# EAGLE design PCB4 (EAGLE 8.1.0)
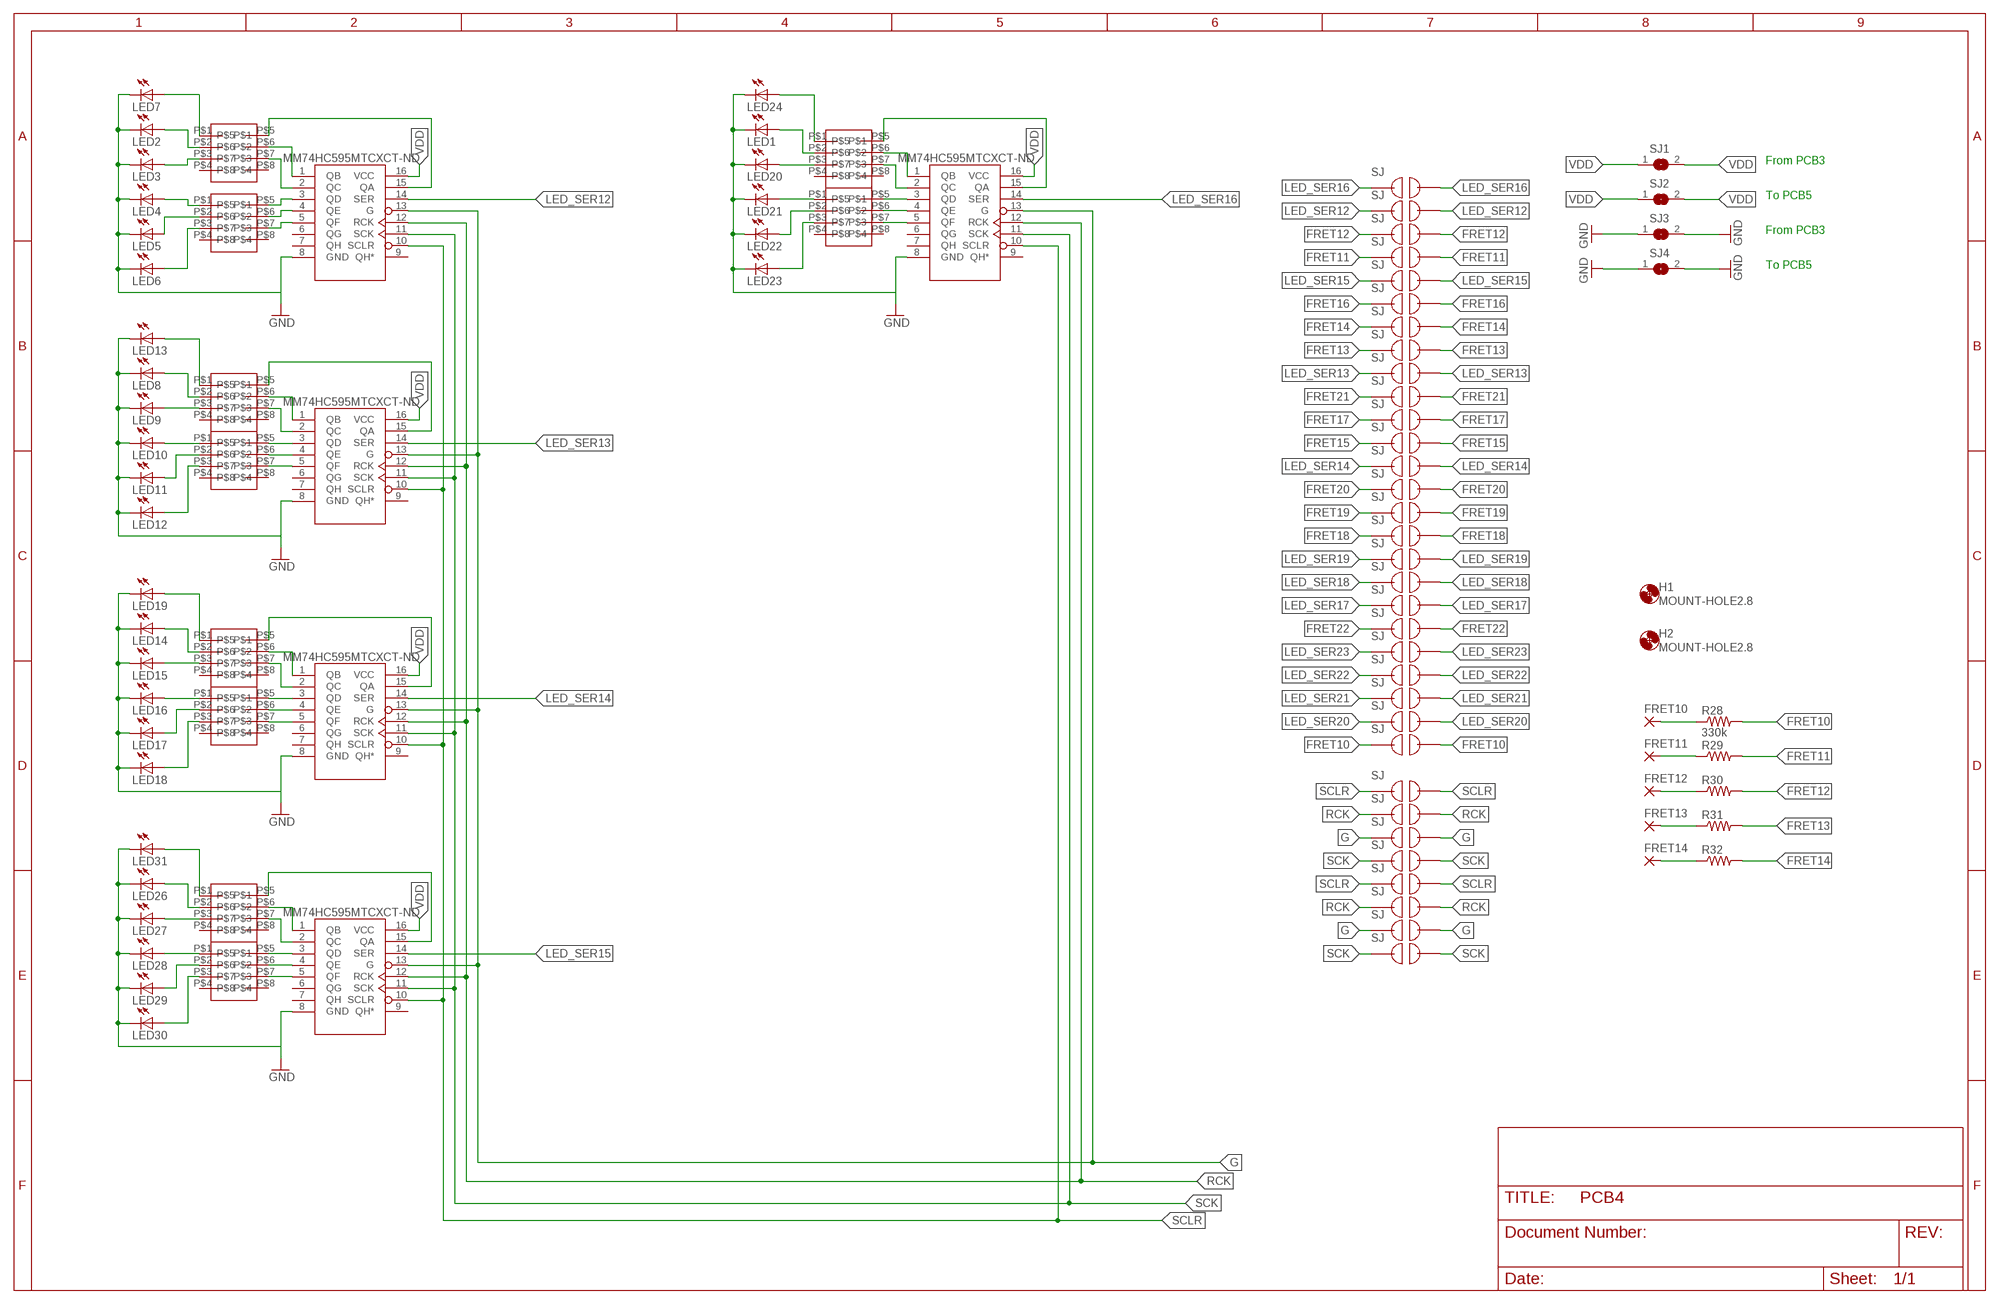
[diagram p0: schematic, sheet 1]

## Parts
FRET10  2,54/0,9  [2,54/0,9]
FRET11  2,54/0,9  [2,54/0,9]
FRET12  2,54/0,9  [2,54/0,9]
FRET13  2,54/0,9  [2,54/0,9]
FRET14  2,54/0,9  [2,54/0,9]
H1  MOUNT-HOLE2.8  [2,8]
H2  MOUNT-HOLE2.8  [2,8]
LED1  LEDSMT1206  [1206]
LED2  LEDSMT1206  [1206]
LED3  LEDSMT1206  [1206]
LED4  LEDSMT1206  [1206]
LED5  LEDSMT1206  [1206]
LED6  LEDSMT1206  [1206]
LED7  LEDSMT1206  [1206]
LED8  LEDSMT1206  [1206]
LED9  LEDSMT1206  [1206]
LED10  LEDSMT1206  [1206]
LED11  LEDSMT1206  [1206]
LED12  LEDSMT1206  [1206]
LED13  LEDSMT1206  [1206]
LED14  LEDSMT1206  [1206]
LED15  LEDSMT1206  [1206]
LED16  LEDSMT1206  [1206]
LED17  LEDSMT1206  [1206]
LED18  LEDSMT1206  [1206]
LED19  LEDSMT1206  [1206]
LED20  LEDSMT1206  [1206]
LED21  LEDSMT1206  [1206]
LED22  LEDSMT1206  [1206]
LED23  LEDSMT1206  [1206]
LED24  LEDSMT1206  [1206]
LED26  LEDSMT1206  [1206]
LED27  LEDSMT1206  [1206]
LED28  LEDSMT1206  [1206]
LED29  LEDSMT1206  [1206]
LED30  LEDSMT1206  [1206]
LED31  LEDSMT1206  [1206]
R28  330k  R-US_R0805  [R0805]
R29  R-US_R0805  [R0805]
R30  R-US_R0805  [R0805]
R31  R-US_R0805  [R0805]
R32  R-US_R0805  [R0805]
SJ1  SJ  [SJ]
SJ2  SJ  [SJ]
SJ3  SJ  [SJ]
SJ4  SJ  [SJ]
U$1  MM74HC595TSSOP-LD16  [MM74HC595MTCXCT-ND]
U$2  MM74HC595TSSOP-LD16  [MM74HC595MTCXCT-ND]
U$3  MM74HC595TSSOP-LD16  [MM74HC595MTCXCT-ND]
U$4  MM74HC595TSSOP-LD16  [MM74HC595MTCXCT-ND]
U$5  MM74HC595TSSOP-LD16  [MM74HC595MTCXCT-ND]
U$6  MNR04MRAPJ680  [MNR04]
U$7  MNR04MRAPJ680  [MNR04]
U$8  MNR04MRAPJ680  [MNR04]
U$9  MNR04MRAPJ680  [MNR04]
U$10  MNR04MRAPJ680  [MNR04]
U$11  MNR04MRAPJ680  [MNR04]
U$12  MNR04MRAPJ680  [MNR04]
U$13  MNR04MRAPJ680  [MNR04]
U$14  MNR04MRAPJ680  [MNR04]
U$15  MNR04MRAPJ680  [MNR04]
U$19  JUMPER  [JUMPER]
U$42  JUMPER  [JUMPER]
U$45  JUMPER  [JUMPER]
U$46  JUMPER  [JUMPER]
U$47  JUMPER  [JUMPER]
U$48  JUMPER  [JUMPER]
U$49  JUMPER  [JUMPER]
U$50  JUMPER  [JUMPER]
U$51  JUMPER  [JUMPER]
U$52  JUMPER  [JUMPER]
U$53  JUMPER  [JUMPER]
U$54  JUMPER  [JUMPER]
U$55  JUMPER  [JUMPER]
U$56  JUMPER  [JUMPER]
U$57  JUMPER  [JUMPER]
U$58  JUMPER  [JUMPER]
U$59  JUMPER  [JUMPER]
U$60  JUMPER  [JUMPER]
U$61  JUMPER  [JUMPER]
U$62  JUMPER  [JUMPER]
U$63  JUMPER  [JUMPER]
U$64  JUMPER  [JUMPER]
U$65  JUMPER  [JUMPER]
U$66  JUMPER  [JUMPER]
U$67  JUMPER  [JUMPER]
U$68  JUMPER  [JUMPER]
U$69  JUMPER  [JUMPER]
U$79  JUMPER  [JUMPER]
U$80  JUMPER  [JUMPER]
U$81  JUMPER  [JUMPER]
U$82  JUMPER  [JUMPER]
U$83  JUMPER  [JUMPER]
U$84  JUMPER  [JUMPER]

## Nets
FRET10: R28.2 U$69.P$1 U$69.P$2
FRET11: R29.2 U$48.P$1 U$48.P$2
FRET12: R30.2 U$47.P$1 U$47.P$2
FRET13: R31.2 U$52.P$1 U$52.P$2
FRET14: R32.2 U$51.P$1 U$51.P$2
FRET15: U$56.P$1 U$56.P$2
FRET16: U$50.P$1 U$50.P$2
FRET17: U$55.P$1 U$55.P$2
FRET18: U$60.P$1 U$60.P$2
FRET19: U$59.P$1 U$59.P$2
FRET20: U$58.P$1 U$58.P$2
FRET21: U$54.P$1 U$54.P$2
FRET22: U$64.P$1 U$64.P$2
G: U$1.13(G) U$2.13(G) U$3.13(G) U$4.13(G) U$5.13(G) U$80.P$1 U$80.P$2 U$84.P$1 U$84.P$2
GND: LED1.C LED2.C LED3.C LED4.C LED5.C LED6.C LED7.C LED8.C LED9.C LED10.C LED11.C LED12.C LED13.C LED14.C LED15.C LED16.C LED17.C LED18.C LED19.C LED20.C LED21.C LED22.C LED23.C LED24.C LED26.C LED27.C LED28.C LED29.C LED30.C LED31.C SJ3.1 SJ3.2 SJ4.1 SJ4.2 U$1.8(GND) U$2.8(GND) U$3.8(GND) U$4.8(GND) U$5.8(GND)
LED_SER12: U$4.14(SER) U$46.P$1 U$46.P$2
LED_SER13: U$1.14(SER) U$53.P$1 U$53.P$2
LED_SER14: U$3.14(SER) U$57.P$1 U$57.P$2
LED_SER15: U$5.14(SER) U$49.P$1 U$49.P$2
LED_SER16: U$2.14(SER) U$45.P$1 U$45.P$2
LED_SER17: U$63.P$1 U$63.P$2
LED_SER18: U$62.P$1 U$62.P$2
LED_SER19: U$61.P$1 U$61.P$2
LED_SER20: U$68.P$1 U$68.P$2
LED_SER21: U$67.P$1 U$67.P$2
LED_SER22: U$66.P$1 U$66.P$2
LED_SER23: U$65.P$1 U$65.P$2
N$1: LED2.A U$6.P$2
N$2: U$4.1(QB) U$6.P$6
N$3: LED3.A U$6.P$3
N$4: U$4.2(QC) U$6.P$7
N$5: LED4.A U$7.P$1
N$6: LED7.A U$6.P$1
N$7: U$4.15(QA) U$6.P$5
N$8: LED5.A U$7.P$2
N$9: U$4.3(QD) U$7.P$5
N$10: U$4.4(QE) U$7.P$6
N$11: U$4.5(QF) U$7.P$7
N$12: LED6.A U$7.P$3
N$13: LED13.A U$8.P$1
N$14: LED8.A U$8.P$2
N$15: U$1.1(QB) U$8.P$6
N$16: U$1.2(QC) U$8.P$7
N$17: LED9.A U$8.P$3
N$18: LED10.A U$9.P$1
N$19: U$1.3(QD) U$9.P$5
N$20: LED11.A U$9.P$2
N$21: U$1.4(QE) U$9.P$6
N$22: U$1.5(QF) U$9.P$7
N$23: LED12.A U$9.P$3
N$24: U$1.15(QA) U$8.P$5
N$25: LED19.A U$10.P$1
N$26: LED14.A U$10.P$2
N$27: U$3.1(QB) U$10.P$6
N$28: U$3.2(QC) U$10.P$7
N$29: LED15.A U$10.P$3
N$30: LED16.A U$11.P$1
N$31: U$3.3(QD) U$11.P$5
N$32: U$3.4(QE) U$11.P$6
N$33: U$3.5(QF) U$11.P$7
N$34: LED18.A U$11.P$3
N$35: LED17.A U$11.P$2
N$36: LED31.A U$12.P$1
N$37: LED26.A U$12.P$2
N$38: LED27.A U$12.P$3
N$39: U$5.2(QC) U$12.P$7
N$40: U$3.15(QA) U$10.P$5
N$41: U$5.1(QB) U$12.P$6
N$42: U$5.3(QD) U$13.P$5
N$43: U$5.4(QE) U$13.P$6
N$44: U$5.5(QF) U$13.P$7
N$45: U$2.15(QA) U$14.P$5
N$46: LED28.A U$13.P$1
N$47: LED29.A U$13.P$2
N$48: LED30.A U$13.P$3
N$49: LED24.A U$14.P$1
N$50: LED1.A U$14.P$2
N$51: LED20.A U$14.P$3
N$52: U$2.1(QB) U$14.P$6
N$53: U$2.2(QC) U$14.P$7
N$54: U$2.3(QD) U$15.P$5
N$55: U$2.4(QE) U$15.P$6
N$56: U$2.5(QF) U$15.P$7
N$57: LED23.A U$15.P$3
N$58: FRET10.1(P) R28.1
N$59: FRET11.1(P) R29.1
N$60: LED22.A U$15.P$2
N$61: LED21.A U$15.P$1
N$62: FRET12.1(P) R30.1
N$63: FRET13.1(P) R31.1
N$64: FRET14.1(P) R32.1
N$66: U$5.15(QA) U$12.P$5
RCK: U$1.12(RCK) U$2.12(RCK) U$3.12(RCK) U$4.12(RCK) U$5.12(RCK) U$79.P$1 U$79.P$2 U$83.P$1 U$83.P$2
SCK: U$1.11(SCK) U$2.11(SCK) U$3.11(SCK) U$4.11(SCK) U$5.11(SCK) U$42.P$1 U$42.P$2 U$81.P$1 U$81.P$2
SCLR: U$1.10(SCLR) U$2.10(SCLR) U$3.10(SCLR) U$4.10(SCLR) U$5.10(SCLR) U$19.P$1 U$19.P$2 U$82.P$1 U$82.P$2
VDD: SJ1.1 SJ1.2 SJ2.1 SJ2.2 U$1.16(VCC) U$2.16(VCC) U$3.16(VCC) U$4.16(VCC) U$5.16(VCC)
Unconnected: U$1.6(QG) U$1.7(QH) U$1.9(QH*) U$2.6(QG) U$2.7(QH) U$2.9(QH*) U$3.6(QG) U$3.7(QH) U$3.9(QH*) U$4.6(QG) U$4.7(QH) U$4.9(QH*) U$5.6(QG) U$5.7(QH) U$5.9(QH*) U$6.P$4 U$6.P$8 U$7.P$4 U$7.P$8 U$8.P$4 U$8.P$8 U$9.P$4 U$9.P$8 U$10.P$4 U$10.P$8 U$11.P$4 U$11.P$8 U$12.P$4 U$12.P$8 U$13.P$4 U$13.P$8 U$14.P$4 U$14.P$8 U$15.P$4 U$15.P$8

## Notes on the sheet
- From PCB3
- To PCB5
- From PCB3
- To PCB5

## Library data of the parts
FRET10-FRET14 = wirepad:2,54/0,9: THROUGH-HOLE PAD
H1 H2 = holes:MOUNT-HOLE: MOUNTING HOLE with drill center marker
LED1-LED24 LED26-LED31 = led:LED: LED OSRAM: - CHIPLED LG R971, LG N971, LY N971, LG Q971, LY Q971, LO R971, LY R971 LH N974, LH R974 LS Q976, LO Q976, LY Q976 LO Q996 - Hyper CHIPLED LW Q18S LB Q993, LB Q99A, LB R99A - SideLED LS A670, LO A670, LY A670, LG A670, LP A670 LB A673, LV A673, LT A673, LW A673 LH A674 LY A675 LS A676, LA A676, LO A676, LY A676, LW A676 LS A679, LY A679, LG A679 - Hyper Micro SIDELED® LS Y876, LA Y876, LO Y876, LY Y876 LT Y87S - SmartLED LW L88C, LW L88S LB L89C, LB L89S, LG L890 LS L89K, LO L89K, LY L89K LS L896, LA L896, LO L896, LY L896 - TOPLED LS T670, LO T670, LY T670, LG T670, LP T670 LSG T670, LSP T670, LSY T670, LOP T670, LYG T670 LG T671, LOG T671, LSG T671 LB T673, LV T673, LT T673, LW T673 LH T674 LS T676, LA T676, LO T676, LY T676, LB T676, LH T676, LSB T676, LW T676 LB T67C, LV T67C, LT T67C, LS T67K, LO T67K, LY T67K, LW E67C LS E67B, LA E67B, LO E67B, LY E67B, LB E67C, LV E67C, LT E67C LW T67C LS T679, LY T679, LG T679 LS T770, LO T770, LY T770, LG T770, LP T770 LB T773, LV T773, LT T773, LW T773 LH T774 LS E675, LA E675, LY E675, LS T675 LS T776, LA T776, LO T776, LY T776, LB T776 LHGB T686 LT T68C, LB T68C - Hyper Mini TOPLED® LB M676 - Mini TOPLED Santana® LG M470 LS M47K, LO M47K, LY M47K Source: http://www.osram.convergy.de LUXEON: - LUMILED® LXK2-PW12-R00, LXK2-PW12-S00, LXK2-PW14-U00, LXK2-PW14-V00 LXK2-PM12-R00, LXK2-PM12-S00, LXK2-PM14-U00 LXK2-PE12-Q00, LXK2-PE12-R00, LXK2-PE12-S00, LXK2-PE14-T00, LXK2-PE14-U00 LXK2-PB12-K00, LXK2-PB12-L00, LXK2-PB12-M00, LXK2-PB14-N00, LXK2-PB14-P00, LXK2-PB14-Q00 LXK2-PR12-L00, LXK2-PR12-M00, LXK2-PR14-Q00, LXK2-PR14-R00 LXK2-PD12-Q00, LXK2-PD12-R00, LXK2-PD12-S00 LXK2-PH12-R00, LXK2-PH12-S00 LXK2-PL12-P00, LXK2-PL12-Q00, LXK2-PL12-R00 Source: www.luxeon.com KINGBRIGHT: KA-3528ASYC Source: www.kingbright.com
R28-R32 = rcl:R-US_: RESISTOR, American symbol
SJ1-SJ4 = jumper:SJ: SMD solder JUMPER
U$1-U$5 = ECE477_Guitutar:MM74HC595
U$6-U$15 = ECE477_Guitutar:MNR04MRAPJ680
U$19 U$42 U$45-U$69 U$79-U$84 = ECE477_Guitutar:JUMPER

## Board
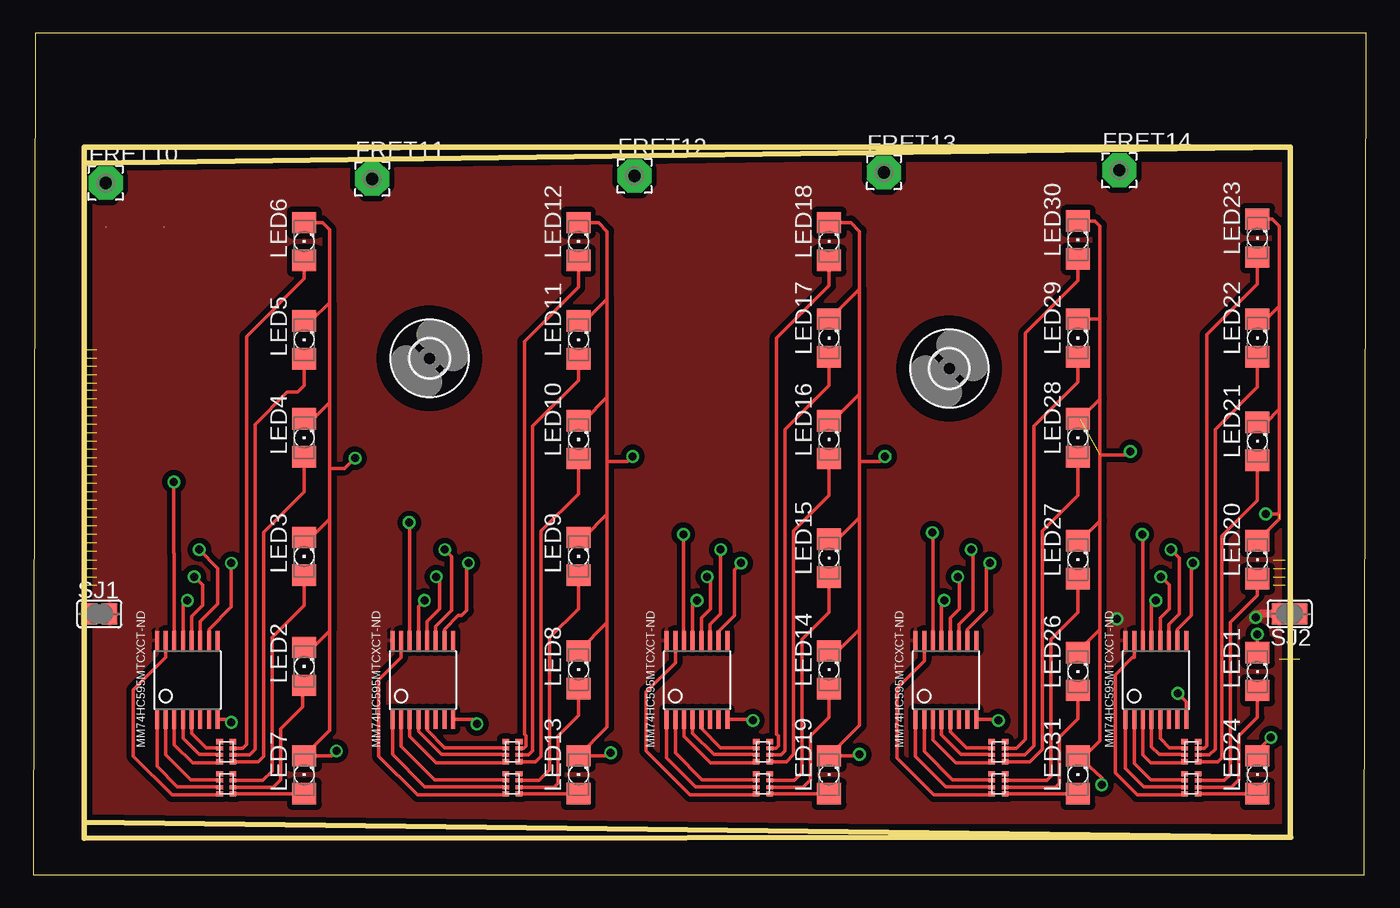
[diagram p1: board, top side]
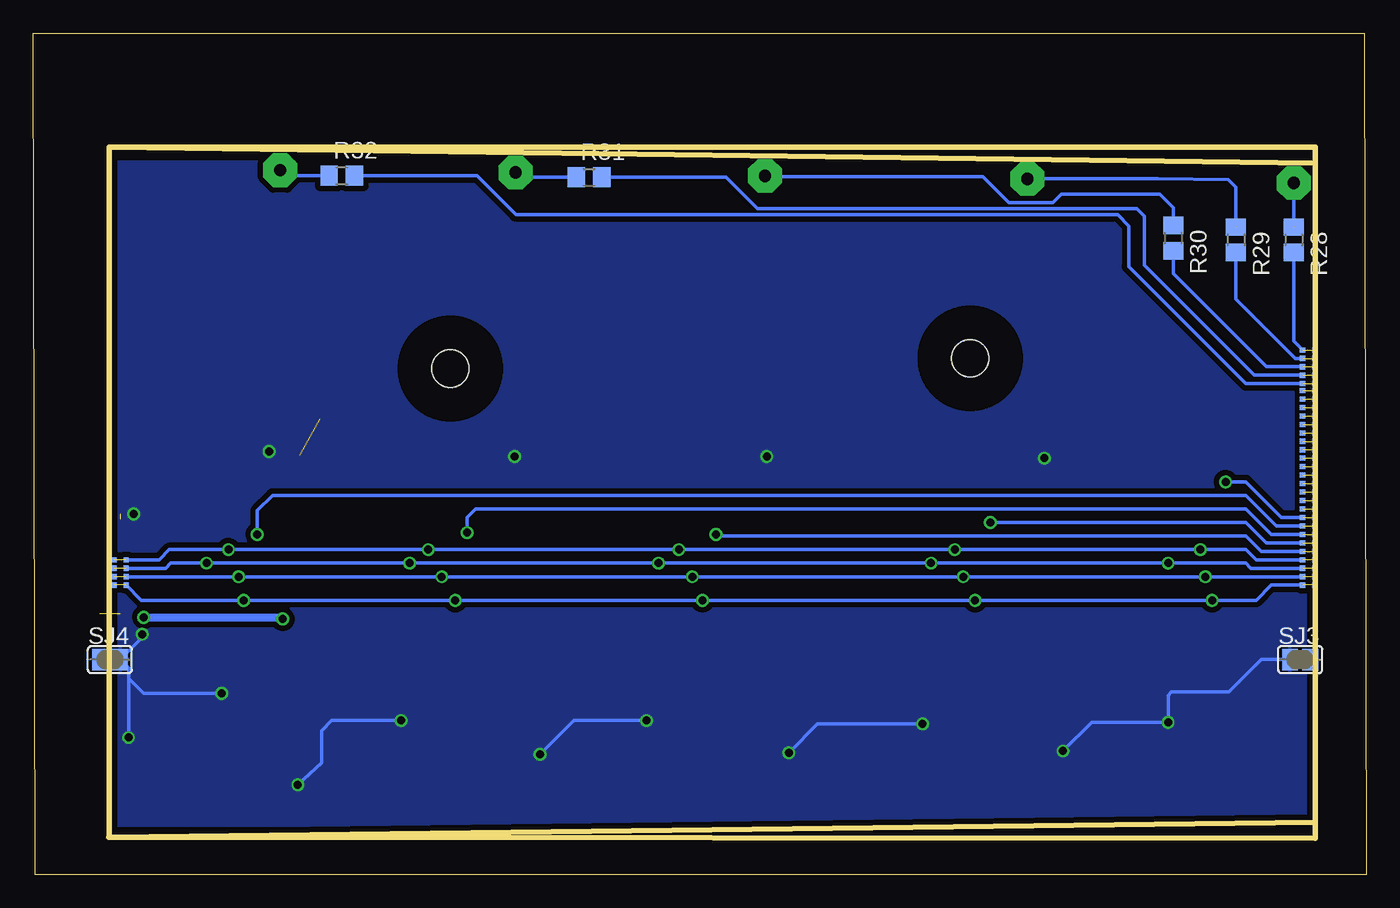
[diagram p2: board, bottom side, seen from below]

Size 99.98 x 63.12 mm. Coordinates in mm from the lower left corner, seen from the top.
Outline: 94.28,54.56 3.81,54.56 3.81,53.39
Outline: 94.28,54.56 94.3,54.56 94.3,2.79 3.81,2.74 3.81,3.94
Outline: 3.81,3.94 3.81,7.49 3.81,15.49 3.81,53.39
Outline: 94.28,54.56 3.81,53.39
Outline: 94.31,2.79 3.81,3.94
Outline: 0,0 99.85,0 99.98,63.12 0.13,63.12 0,0
Copper layers (1*16): Top 0.0356mm / dielectric 1.5011mm / Bottom 0.0356mm
Design rules "ECE_Senior_Design": minimum track width 8mil, minimum drill 13mil, track to track 8mil, track to pad 8mil, pad to pad 6mil, via to via 8mil, smd to smd 6mil, copper to edge 15mil, drill to drill 8mil, minimum pad ring 7mil, minimum via ring 7mil, stop-mask expansion 3mil, vias tented up to drill 0mil, thermal gap 10mil

### Footprints (pad centres in the part's own frame; a part is rotated, then mirrored left to right if it is on the bottom)
2,54/0,9 = drill 0.914 pad 2.54 octagon: 1 0,0
2,8 = hole 2.8: 0,0
1206 = smd 1.6 x 1.803: A -1.422,0; C 1.422,0
R0805 = smd 1.3 x 1.5: 1 -0.95,0; 2 0.95,0
SJ = smd 1.168 x 1.6: 1 -0.762,0; 2 0.762,0
MM74HC595MTCXCT-ND = smd 0.3 x 1.45: 1 -2.275,-2.95; 2 -1.625,-2.95; 3 -0.975,-2.95; 4 -0.325,-2.95; 5 0.325,-2.95; 6 0.975,-2.95; 7 1.625,-2.95; 8 2.275,-2.95; 9 2.275,2.95; 10 1.625,2.95; 11 0.975,2.95; 12 0.325,2.95; 13 -0.325,2.95; 14 -0.975,2.95; 15 -1.625,2.95; 16 -2.275,2.95
MNR04 = smd 0.4 x 0.5: P$1 -0.8,-0.5; P$4 0.7,-0.5; P$5 -0.8,0.5; P$8 0.7,0.5 | smd 0.3 x 0.5: P$2 -0.3,-0.5; P$3 0.2,-0.5; P$6 -0.3,0.5; P$7 0.2,0.5
JUMPER = smd 0.381 x 0.381: P$1 -0.454,0; P$2 0.454,0

### Placement (x,y rotation side)
FRET10  5.42,51.89 0 top
FRET11  25.41,52.2 0 top
FRET12  45.1,52.43 0 top
FRET13  63.8,52.68 0 top
FRET14  81.46,52.84 0 top
H1  68.71,37.97 0 top
H2  29.72,38.73 0 top
LED1  91.82,15.24 90 top
LED2  20.32,15.62 90 top
LED3  20.32,23.88 90 top
LED4  20.32,32.77 90 top
LED5  20.32,40.13 90 top
LED6  20.32,47.5 90 top
LED7  20.32,7.49 90 top
LED8  40.89,15.37 90 top
LED9  40.89,23.88 90 top
LED10  40.89,32.64 90 top
LED11  40.89,40.13 90 top
LED12  40.89,47.5 90 top
LED13  40.89,7.49 90 top
LED14  59.69,15.37 90 top
LED15  59.69,23.75 90 top
LED16  59.69,32.64 90 top
LED17  59.69,40.26 90 top
LED18  59.69,47.5 90 top
LED19  59.69,7.49 90 top
LED20  91.82,23.62 90 top
LED21  91.82,32.51 90 top
LED22  91.82,40.26 90 top
LED23  91.82,47.75 90 top
LED24  91.82,7.49 90 top
LED26  78.36,15.24 90 top
LED27  78.36,23.62 90 top
LED28  78.36,32.77 90 top
LED29  78.36,40.26 90 top
LED30  78.36,47.62 90 top
LED31  78.36,7.49 90 top
R28  5.44,47.62 270 bottom
R29  9.77,47.62 270 bottom
R30  14.48,47.75 270 bottom
R31  58.29,52.31 0 bottom
R32  76.83,52.43 0 bottom
SJ1  4.95,19.56 0 top
SJ2  94.23,19.56 180 top
SJ3  4.95,16.13 0 bottom
SJ4  94.23,16.13 0 bottom
U$1  29.21,14.61 0 top
U$2  84.2,14.61 0 top
U$3  49.78,14.61 0 top
U$4  11.56,14.61 0 top
U$5  68.45,14.61 0 top
U$6  14.48,6.86 90 top
U$7  14.48,9.27 90 top
U$8  35.94,6.86 90 top
U$9  35.94,9.27 90 top
U$10  54.74,6.86 90 top
U$11  54.74,9.27 90 top
U$12  72.39,6.86 90 top
U$13  72.39,9.27 90 top
U$14  86.87,6.86 90 top
U$15  86.87,9.27 90 top
U$19  4.32,22.99 0 bottom
U$42  4.32,23.62 0 bottom
U$45  4.32,26.16 0 bottom
U$46  4.32,26.8 0 bottom
U$47  4.32,38.1 0 bottom
U$48  4.32,38.73 0 bottom
U$49  4.32,25.53 0 bottom
U$50  4.32,35.69 0 bottom
U$51  4.32,36.83 0 bottom
U$52  4.32,37.47 0 bottom
U$53  4.32,24.89 180 bottom
U$54  4.32,32.51 0 bottom
U$55  4.32,35.05 0 bottom
U$56  4.32,36.32 0 bottom
U$57  4.32,24.26 180 bottom
U$58  4.32,33.15 0 bottom
U$59  4.32,33.78 0 bottom
U$60  4.32,34.42 0 bottom
U$61  4.32,29.97 0 bottom
U$62  4.32,30.61 0 bottom
U$63  4.32,31.24 0 bottom
U$64  4.32,31.88 0 bottom
U$65  4.32,27.43 0 bottom
U$66  4.32,28.07 0 bottom
U$67  4.32,28.7 0 bottom
U$68  4.32,29.34 0 bottom
U$69  4.32,39.37 0 bottom
U$79  4.32,22.35 0 bottom
U$80  4.32,21.72 0 bottom
U$81  93.47,23.62 0 bottom
U$82  93.47,22.99 0 bottom
U$83  93.47,22.35 0 bottom
U$84  93.47,21.72 0 bottom

### Tracks (layer width: path | path; a pad name or v marks a point on that pad's centre or on a via)
FRET10  (1 unrouted)
  Bottom 0.254: R28.2 5.44,40.03 U$69.P$1
FRET11  (1 unrouted)
  Bottom 0.254: U$48.P$1 5.33,38.73 9.78,43.18 9.78,45.93 9.77,45.94 R29.2
FRET12  (1 unrouted)
  Bottom 0.254: R30.2 14.48,45.09 7.49,38.1 U$47.P$1
FRET13  (1 unrouted)
  Bottom 0.254: R31.2 48.01,52.31 45.66,49.96 17.2,49.96 16.64,49.4 16.64,45.72 8.38,37.47 U$52.P$1
FRET14  (1 unrouted)
  Bottom 0.254: R32.2 66.7,52.43 63.78,49.51 18.64,49.51 17.81,48.67 17.81,45.62 9.02,36.83 U$51.P$1
FRET15  (1 unrouted)
FRET16  (1 unrouted)
FRET17  (1 unrouted)
FRET18  (1 unrouted)
FRET19  (1 unrouted)
FRET20  (1 unrouted)
FRET21  (1 unrouted)
FRET22  (1 unrouted)
G  (via drill 0.6)  (2 unrouted)
  Top 0.254: U$4.13 11.23,20.25 v11.56,20.57 | U$1.13 28.89,20.12 v29.34,20.57 | U$3.13 49.46,20.25 v49.78,20.57 | U$5.13 68.13,20.38 v68.33,20.57 | U$2.13 83.88,20.25 v84.2,20.57
  Bottom 0.254: U$80.P$1 7.11,21.72 8.26,20.57 v11.56,20.57 v29.34,20.57 v49.78,20.57 v68.33,20.57 v84.2,20.57 91.88,20.57 U$84.P$2
GND  (via drill 0.6)  (3 unrouted)
  Top 0.254: LED6.C 21.69,48.92 22.23,48.39 22.23,42.93 | 22.23,26.67 22.23,18.29 | 22.23,35.43 22.23,26.67 | 22.23,42.93 22.23,35.43 | 22.23,18.29 22.23,10.82 LED7.C 22.38,8.91 v22.73,9.27 | LED2.C 20.98,17.04 22.23,18.29 | LED3.C 20.85,25.3 22.23,26.67 | LED4.C 20.98,34.19 22.23,35.43 | LED5.C 20.85,41.55 22.23,42.93 | LED12.C 42.39,48.92 43.05,48.26 43.05,43.18 | 43.05,27.05 43.05,18.92 | 43.05,35.81 43.05,27.05 | 43.05,43.18 43.05,35.81 | 43.05,18.92 43.05,11.07 LED13.C 43.08,8.91 v43.31,9.14 | LED8.C 40.92,16.79 43.05,18.92 | LED9.C 41.3,25.3 43.05,27.05 | LED10.C 41.3,34.06 43.05,35.81 | LED11.C 41.43,41.55 43.05,43.18 | U$4.8 14.63,11.65 v14.86,11.43 | LED18.C 61.32,48.92 61.98,48.26 61.98,43.94 | 61.98,26.8 61.98,18.41 | 61.98,36.07 61.98,26.8 | 61.98,43.94 61.98,36.07 | 61.98,18.41 61.98,11.2 LED19.C 61.87,8.91 v61.98,9.02 | LED14.C 60.35,16.79 61.98,18.41 | LED15.C 60.35,25.17 61.98,26.8 | LED16.C 59.97,34.06 61.98,36.07 | LED17.C 59.72,41.68 61.98,43.94 | U$1.8 32.92,11.65 v33.27,11.3 | U$3.8 53.88,11.65 v53.98,11.56 | LED30.C 79.63,49.05 80.01,48.67 80.01,41.78 | 80.01,35.69 80.01,41.78 | 80.01,26.54 80.01,35.69 | 80.01,18.41 80.01,26.54 | 80.01,18.41 80.01,10.03 78.89,8.91 LED31.C 80.14,7.26 v80.14,6.73 | LED29.C 79.91,41.68 80.01,41.78 | LED28.C 78.51,34.19 80.01,35.69 | LED27.C 78.51,25.04 80.01,26.54 | LED26.C 78.36,16.76 80.01,18.41 | U$5.8 72.29,11.65 v72.39,11.56 | LED23.C 92.94,49.17 93.47,48.64 93.47,42.67 | 93.47,42.67 93.47,34.92 | 93.47,34.92 93.47,26.7 LED20.C | LED21.C 92.48,33.93 93.47,34.92 | LED22.C 92.48,41.68 93.47,42.67 | LED1.C v91.82,18.03 | LED24.C 91.82,9.27 v92.84,10.29 | U$2.8 86.48,12.96 v85.85,13.59
  Top 0.254: 93.47,27.05 v92.46,27.05 | 22.23,30.48 23.37,30.48 v24.13,31.24 | 43.05,30.99 44.58,30.99 v44.96,31.37 | 61.98,30.99 63.5,30.99 v63.88,31.37 | 80.01,31.5 82.04,31.5 v82.3,31.75
  Bottom 0.254: SJ3.1 7.87,16.13 10.29,13.72 14.61,13.72 14.86,13.46 v14.86,11.43 20.57,11.43 v22.73,9.27 | v33.27,11.3 41.15,11.3 v43.31,9.14 | v53.98,11.56 59.44,11.56 v61.98,9.02 | v72.39,11.56 77.6,11.56 78.36,10.79 78.36,8.38 v80.14,6.73 | v91.82,18.03 91.82,17.78 SJ4.2 92.84,15.49 92.84,14.73 | 92.84,14.73 v92.84,10.29 | v85.85,13.59 91.69,13.59 92.84,14.73
  pour Bottom (isolate 0.406): 3.81,53.47 94.36,53.47 94.36,3.68 3.81,3.68
LED_SER12  (via drill 0.6)  (1 unrouted)
  Top 0.254: U$4.14 10.58,24.09 10.54,24.13 v10.54,29.46
  Bottom 0.254: U$46.P$1 6.35,26.8 9.02,29.46 v10.54,29.46
LED_SER13  (via drill 0.6)  (1 unrouted)
  Top 0.254: U$1.14 28.23,26.38 v28.19,26.42
  Bottom 0.254: U$53.P$2 7.49,24.89 9.02,26.42 v28.19,26.42
LED_SER14  (via drill 0.6)  (1 unrouted)
  Top 0.254: v48.77,25.53 48.77,17.6 U$3.14
  Bottom 0.254: U$57.P$2 7.87,24.26 9.02,25.4 48.64,25.4 v48.77,25.53
LED_SER15  (via drill 0.6)  (1 unrouted)
  Top 0.254: U$5.14 67.48,25.23 v67.44,25.65
  Bottom 0.254: U$49.P$1 7.11,25.53 9.02,27.43 66.8,27.43 67.44,26.8 v67.44,25.65
LED_SER16  (via drill 0.6)  (1 unrouted)
  Top 0.254: U$2.14 83.23,25.49 v83.19,25.53
  Bottom 0.254: U$45.P$1 6.73,26.16 9.02,28.45 82.04,28.45 83.19,27.3 v83.19,25.53
LED_SER17  (1 unrouted)
LED_SER18  (1 unrouted)
LED_SER19  (1 unrouted)
LED_SER20  (1 unrouted)
LED_SER21  (1 unrouted)
LED_SER22  (1 unrouted)
LED_SER23  (1 unrouted)
N$1
  Top 0.254: U$6.P$2 17.99,6.56 18.54,7.11 18.54,10.92 20.19,12.57 20.19,14.07 LED2.A
N$2
  Top 0.254: U$4.1 9.28,8.12 10.79,6.6 13.93,6.6 U$6.P$6
N$3
  Top 0.254: U$6.P$3 17.22,7.06 17.91,7.75 17.91,17.78 20.32,20.19 LED3.A
N$4
  Top 0.254: U$4.2 9.93,8.99 11.81,7.11 13.92,7.11 U$6.P$7
N$5
  Top 0.254: U$7.P$1 16.85,8.47 17.27,8.89 17.27,25.65 20.32,28.7 LED4.A
N$6
  Top 0.254: U$6.P$1 20.31,6.06 LED7.A
N$7
  Top 0.254: U$4.15 9.93,16.28 7.49,13.84 7.49,8.89 10.41,5.97 13.89,5.97 U$6.P$5
N$8
  Top 0.254: U$7.P$2 16.21,8.97 16.64,9.4 16.64,33.78 19.05,36.2 19.81,36.2 20.32,36.7 LED5.A
N$9
  Top 0.254: U$4.3 10.58,9.74 11.94,8.38 13.89,8.38 U$7.P$5
N$10
  Top 0.254: U$4.4 11.23,10.23 12.45,9.02 13.93,9.02 U$7.P$6
N$11
  Top 0.254: U$4.5 11.88,10.6 12.95,9.53 13.92,9.53 U$7.P$7
N$12
  Top 0.254: LED6.A 20.32,44.7 16,40.39 16,9.78 15.69,9.47 U$7.P$3
N$13
  Top 0.254: U$8.P$1 40.88,6.06 LED13.A
N$14
  Top 0.254: U$8.P$2 39.07,6.56 39.37,6.86 39.37,10.41 40.89,11.94 LED8.A
N$15
  Top 0.254: U$1.1 26.93,9.01 29.34,6.6 35.4,6.6 U$8.P$6
N$16
  Top 0.254: U$1.2 27.59,9.63 30.1,7.11 35.39,7.11 U$8.P$7
N$17
  Top 0.254: U$8.P$3 37.92,7.06 38.73,7.87 38.73,17.78 40.89,19.94 LED9.A
N$18
  Top 0.254: U$9.P$1 37.68,8.47 38.1,8.89 38.1,25.78 40.89,28.57 LED10.A
N$19
  Top 0.254: U$1.3 28.23,10.37 30.23,8.38 35.35,8.38 U$9.P$5
N$20
  Top 0.254: U$9.P$2 37.16,8.97 37.47,9.27 37.47,33.66 40.89,37.08 LED11.A
N$21
  Top 0.254: U$1.4 28.89,10.74 30.61,9.02 35.4,9.02 U$9.P$6
N$22
  Top 0.254: U$1.5 29.54,10.85 30.86,9.53 35.39,9.53 U$9.P$7
N$23
  Top 0.254: U$9.P$3 36.78,9.47 36.96,9.65 36.96,10.41 36.83,10.54 36.83,40.01 40.89,44.07 LED12.A
N$24
  Top 0.254: U$1.15 27.59,16.28 25.91,14.61 25.91,8.89 28.83,5.97 35.35,5.97 U$8.P$5
N$25
  Top 0.254: U$10.P$1 59.68,6.06 LED19.A
N$26
  Top 0.254: U$10.P$2 57.74,6.56 58.29,7.11 58.29,10.41 59.69,11.81 LED14.A
N$27
  Top 0.254: U$3.1 47.51,8.75 49.66,6.6 54.19,6.6 U$10.P$6
N$28
  Top 0.254: U$3.2 48.16,9.12 50.16,7.11 54.18,7.11 U$10.P$7
N$29
  Top 0.254: U$10.P$3 57.1,7.06 57.66,7.62 57.66,17.65 59.69,19.68 LED15.A
N$30
  Top 0.254: U$11.P$1 56.48,8.47 57.02,9.02 57.02,25.78 59.69,28.45 LED16.A
N$31
  Top 0.254: U$3.3 48.81,10.37 50.8,8.38 54.15,8.38 U$11.P$5
N$32
  Top 0.254: U$3.4 49.46,10.61 51.05,9.02 54.19,9.02 U$11.P$6
N$33
  Top 0.254: U$3.5 50.11,10.98 51.56,9.53 54.18,9.53 U$11.P$7
N$34
  Top 0.254: U$11.P$3 55.7,9.47 55.88,9.65 55.88,10.41 55.75,10.54 55.75,40.26 59.69,44.2 LED18.A
N$35
  Top 0.254: U$11.P$2 56.09,8.97 56.39,9.27 56.39,33.4 59.69,36.7 LED17.A
N$36
  Top 0.254: U$12.P$1 78.35,6.06 LED31.A
N$37
  Top 0.254: U$12.P$2 76.66,6.56 76.96,6.86 76.96,10.29 78.36,11.68 LED26.A
N$38
  Top 0.254: U$12.P$3 76.02,7.06 76.33,7.37 76.33,17.65 78.36,19.68 LED27.A
N$39
  Top 0.254: U$5.2 66.83,9.24 68.96,7.11 71.84,7.11 U$12.P$7
N$40
  Top 0.254: U$3.15 48.16,15.9 45.97,13.72 45.97,9.27 49.28,5.97 54.15,5.97 U$10.P$5
N$41
  Top 0.254: U$5.1 66.18,8.88 68.45,6.6 71.84,6.6 U$12.P$6
N$42
  Top 0.254: U$5.3 67.48,10.12 69.22,8.38 71.8,8.38 U$13.P$5
N$43
  Top 0.254: U$5.4 68.13,10.48 69.6,9.02 71.84,9.02 U$13.P$6
N$44
  Top 0.254: U$5.5 68.78,10.72 69.98,9.53 71.84,9.53 U$13.P$7
N$45
  Top 0.254: U$2.15 82.58,16.28 82.45,16.28 81.15,14.99 81.15,7.62 82.8,5.97 86.28,5.97 U$14.P$5
N$46
  Top 0.254: U$13.P$1 74.77,8.47 75.69,9.4 75.69,25.78 78.36,28.45 LED28.A
N$47
  Top 0.254: U$13.P$2 74.38,8.97 75.06,9.65 75.06,33.66 78.36,36.96 LED29.A
N$48
  Top 0.254: U$13.P$3 73.73,9.47 74.42,10.16 74.42,40.64 78.36,44.58 LED30.A
N$49
  Top 0.254: U$14.P$1 91.81,6.06 LED24.A
N$50
  Top 0.254: U$14.P$2 89.87,6.56 90.42,7.11 90.42,10.41 91.82,11.81 LED1.A
N$51
  Top 0.254: U$14.P$3 89.35,7.06 89.79,7.49 89.79,18.92 91.82,20.95 LED20.A
N$52
  Top 0.254: U$2.1 81.93,7.99 83.31,6.6 86.32,6.6 U$14.P$6
N$53
  Top 0.254: U$2.2 82.58,8.36 83.82,7.11 86.31,7.11 U$14.P$7
N$54
  Top 0.254: U$2.3 83.23,8.98 83.82,8.38 86.28,8.38 U$15.P$5
N$55
  Top 0.254: U$2.4 83.88,9.6 84.45,9.02 86.32,9.02 U$15.P$6
N$56
  Top 0.254: U$2.5 84.53,10.22 85.22,9.53 86.31,9.53 U$15.P$7
N$57
  Top 0.254: U$15.P$3 87.83,9.47 88.01,9.65 88.01,40.51 91.82,44.32 LED23.A
N$58  (1 unrouted)
  Bottom 0.254: FRET10.1 5.42,48.6
N$59  (1 unrouted)
  Bottom 0.254: FRET11.1 15.62,52.2 10.35,52.13 9.78,51.56 9.78,48.62
N$60
  Top 0.254: U$15.P$2 88.22,8.97 88.65,9.4 88.65,33.4 91.82,36.58 LED22.A
N$61
  Top 0.254: U$15.P$1 88.86,8.47 89.15,8.76 89.15,25.4 91.82,28.07 LED21.A
N$62
  Bottom 0.254: R30.1 14.48,50.04 15.49,51.05 22.86,51.05 23.5,50.42 26.8,50.42 28.74,52.37 45.04,52.37 FRET12.1
N$63
  Bottom 0.254: R31.1 63.44,52.31 FRET13.1
N$64
  Bottom 0.254: R32.1 81.04,52.43 FRET14.1
N$66
  Top 0.254: U$5.15 66.83,16.03 64.77,13.97 64.77,8.76 67.56,5.97 71.8,5.97 U$12.P$5
RCK  (via drill 0.6)  (2 unrouted)
  Top 0.254: U$4.12 11.88,19.38 12.7,20.19 12.7,21.72 v12.06,22.35 | U$1.12 29.54,18.99 30.48,19.94 30.48,22.1 v30.23,22.35 | U$3.12 50.11,19.25 50.8,19.94 50.8,22.1 v50.55,22.35 | U$5.12 68.78,19.25 69.47,19.94 69.47,22.23 v69.34,22.35 | U$2.12 84.53,19.25 85.22,19.94 85.22,21.72 v84.58,22.35
  Bottom 0.254: U$79.P$1 v12.06,22.35 v30.23,22.35 v50.55,22.35 v69.34,22.35 v84.58,22.35 U$83.P$2
SCK  (via drill 0.6)  (2 unrouted)
  Top 0.254: U$4.11 12.53,19.01 13.84,20.32 13.84,22.99 v12.45,24.38 | U$1.11 30.18,18.63 31.37,19.81 31.37,23.88 v30.86,24.38 | U$3.11 50.76,18.75 51.56,19.56 v51.56,24.38 | U$5.11 69.43,18.75 70.48,19.81 70.48,24.26 v70.36,24.38 | U$2.11 85.18,18.75 85.98,19.56 85.98,23.75 v85.34,24.38
  Bottom 0.254: U$42.P$1 8.26,23.62 9.02,24.38 v12.45,24.38 v30.86,24.38 v51.56,24.38 v70.36,24.38 v85.34,24.38 89.79,24.38 90.55,23.62 U$81.P$2
SCLR  (via drill 0.6)  (2 unrouted)
  Top 0.254: U$4.10 13.18,18.39 14.86,20.07 v14.86,23.37 | U$1.10 30.84,18.39 31.88,19.43 32.13,19.43 32.51,19.81 32.51,23.24 v32.64,23.37 | U$3.10 51.41,18.26 52.58,19.43 52.58,22.86 v53.09,23.37 | U$5.10 70.08,18.39 71.5,19.81 71.5,23.11 v71.75,23.37 | U$2.10 85.83,18.39 86.87,19.43 86.87,23.24 v87,23.37
  Bottom 0.254: U$19.P$1 8.64,22.99 9.02,23.37 v14.86,23.37 v32.64,23.37 v53.09,23.37 v71.75,23.37 v87,23.37 89.66,23.37 90.04,22.99 U$82.P$2
VDD  (via drill 0.6)  (1 unrouted)
  Top 0.61: SJ2.2 91.95,19.56 v91.69,19.3
  Bottom 0.61: v91.69,19.3 81.41,19.3 v81.28,19.18
  pour Top (isolate 0.406): 3.94,53.34 94.23,53.34 94.23,3.94 3.94,3.94